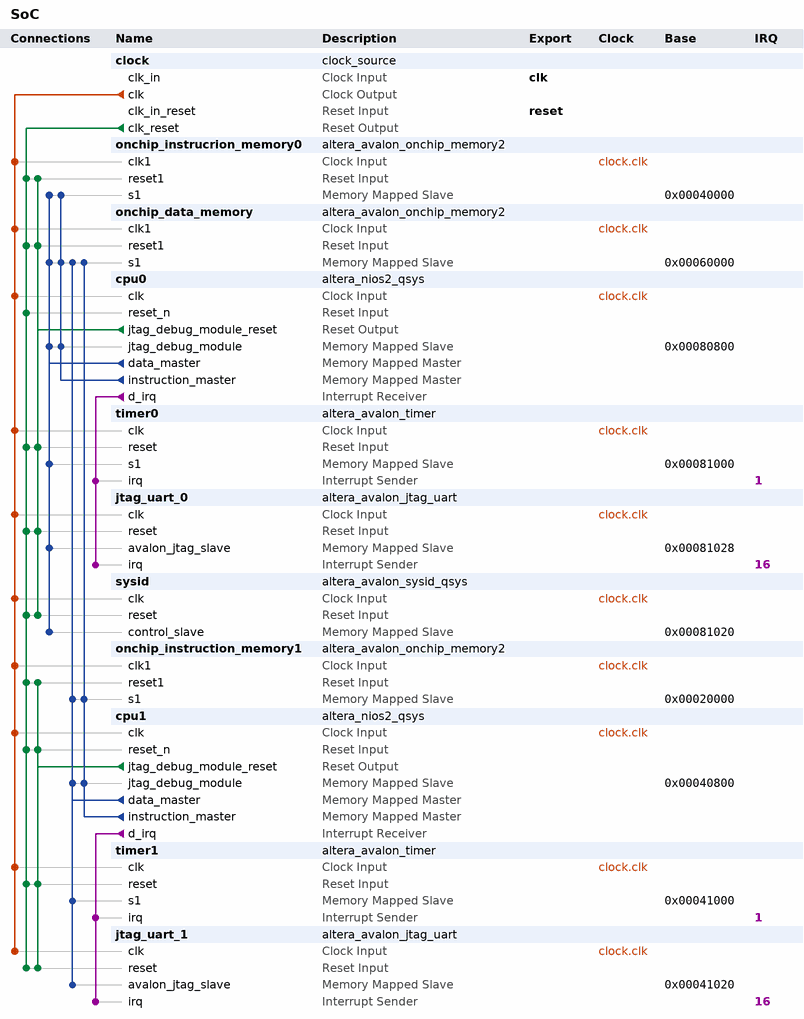
[diagram p0: system contents]
# Platform Designer (Qsys) system SoC, Cyclone IV E EP4CE115F29C7
# Parameters at their usual value, and those the tool derives, are not listed.
package require -exact qsys 12.1
create_system SoC
set_project_property DEVICE_FAMILY {Cyclone IV E}
set_project_property DEVICE EP4CE115F29C7

add_instance clock clock_source 12.1
set_instance_parameter_value clock clockFrequency 50000000

add_instance onchip_instrucrion_memory0 altera_avalon_onchip_memory2 12.1
set_instance_parameter_value onchip_instrucrion_memory0 dataWidth 32
set_instance_parameter_value onchip_instrucrion_memory0 dualPort false
set_instance_parameter_value onchip_instrucrion_memory0 initMemContent true
set_instance_parameter_value onchip_instrucrion_memory0 initializationFileName onchip_instrucrion_memory0
set_instance_parameter_value onchip_instrucrion_memory0 memorySize 98304

add_instance onchip_data_memory altera_avalon_onchip_memory2 12.1
set_instance_parameter_value onchip_data_memory dataWidth 32
set_instance_parameter_value onchip_data_memory dualPort false
set_instance_parameter_value onchip_data_memory initMemContent true
set_instance_parameter_value onchip_data_memory initializationFileName onchip_data_memory
set_instance_parameter_value onchip_data_memory memorySize 98304

add_instance cpu0 altera_nios2_qsys 12.1
set_instance_parameter_value cpu0 resetSlave onchip_instrucrion_memory0.s1
set_instance_parameter_value cpu0 exceptionSlave onchip_instrucrion_memory0.s1
set_instance_parameter_value cpu0 breakSlave cpu0.jtag_debug_module
set_instance_parameter_value cpu0 impl Small
set_instance_parameter_value cpu0 icache_size 4096

add_instance timer0 altera_avalon_timer 12.1
set_instance_parameter_value timer0 period 1
set_instance_parameter_value timer0 periodUnits MSEC
set_instance_parameter_value timer0 timerPreset CUSTOM

add_instance jtag_uart_0 altera_avalon_jtag_uart 12.1
set_instance_parameter_value jtag_uart_0 simInteractiveOptions INTERACTIVE_ASCII_OUTPUT

add_instance sysid altera_avalon_sysid_qsys 12.1
set_instance_parameter_value sysid id 0

add_instance onchip_instruction_memory1 altera_avalon_onchip_memory2 12.1
set_instance_parameter_value onchip_instruction_memory1 dataWidth 32
set_instance_parameter_value onchip_instruction_memory1 dualPort false
set_instance_parameter_value onchip_instruction_memory1 initMemContent true
set_instance_parameter_value onchip_instruction_memory1 initializationFileName onchip_instruction_memory1
set_instance_parameter_value onchip_instruction_memory1 memorySize 98304

add_instance cpu1 altera_nios2_qsys 12.1
set_instance_parameter_value cpu1 resetSlave onchip_instruction_memory1.s1
set_instance_parameter_value cpu1 exceptionSlave onchip_instruction_memory1.s1
set_instance_parameter_value cpu1 breakSlave cpu1.jtag_debug_module
set_instance_parameter_value cpu1 impl Small
set_instance_parameter_value cpu1 icache_size 4096

add_instance timer1 altera_avalon_timer 12.1
set_instance_parameter_value timer1 period 1
set_instance_parameter_value timer1 periodUnits MSEC
set_instance_parameter_value timer1 timerPreset CUSTOM

add_instance jtag_uart_1 altera_avalon_jtag_uart 12.1
set_instance_parameter_value jtag_uart_1 simInteractiveOptions INTERACTIVE_ASCII_OUTPUT

# connections
add_connection clock.clk cpu0.clk clock
add_connection clock.clk cpu1.clk clock
add_connection clock.clk jtag_uart_0.clk clock
add_connection clock.clk jtag_uart_1.clk clock
add_connection clock.clk onchip_data_memory.clk1 clock
add_connection clock.clk onchip_instrucrion_memory0.clk1 clock
add_connection clock.clk onchip_instruction_memory1.clk1 clock
add_connection clock.clk sysid.clk clock
add_connection clock.clk timer0.clk clock
add_connection clock.clk timer1.clk clock
add_connection clock.clk_reset cpu0.reset_n reset
add_connection clock.clk_reset cpu1.reset_n reset
add_connection clock.clk_reset jtag_uart_0.reset reset
add_connection clock.clk_reset jtag_uart_1.reset reset
add_connection clock.clk_reset onchip_data_memory.reset1 reset
add_connection clock.clk_reset onchip_instrucrion_memory0.reset1 reset
add_connection clock.clk_reset onchip_instruction_memory1.reset1 reset
add_connection clock.clk_reset sysid.reset reset
add_connection clock.clk_reset timer0.reset reset
add_connection clock.clk_reset timer1.reset reset
add_connection cpu0.jtag_debug_module_reset jtag_uart_0.reset reset
add_connection cpu0.jtag_debug_module_reset onchip_data_memory.reset1 reset
add_connection cpu0.jtag_debug_module_reset onchip_instrucrion_memory0.reset1 reset
add_connection cpu0.jtag_debug_module_reset sysid.reset reset
add_connection cpu0.jtag_debug_module_reset timer0.reset reset
add_connection cpu1.jtag_debug_module_reset cpu1.reset_n reset
add_connection cpu1.jtag_debug_module_reset jtag_uart_1.reset reset
add_connection cpu1.jtag_debug_module_reset onchip_instruction_memory1.reset1 reset
add_connection cpu1.jtag_debug_module_reset timer1.reset reset
add_connection cpu0.data_master cpu0.jtag_debug_module avalon
set_connection_parameter_value cpu0.data_master/cpu0.jtag_debug_module baseAddress 0x00080800
add_connection cpu0.data_master jtag_uart_0.avalon_jtag_slave avalon
set_connection_parameter_value cpu0.data_master/jtag_uart_0.avalon_jtag_slave baseAddress 0x00081028
add_connection cpu0.data_master onchip_data_memory.s1 avalon
set_connection_parameter_value cpu0.data_master/onchip_data_memory.s1 baseAddress 0x00060000
add_connection cpu0.data_master onchip_instrucrion_memory0.s1 avalon
set_connection_parameter_value cpu0.data_master/onchip_instrucrion_memory0.s1 baseAddress 0x00040000
add_connection cpu0.data_master sysid.control_slave avalon
set_connection_parameter_value cpu0.data_master/sysid.control_slave baseAddress 0x00081020
add_connection cpu0.data_master timer0.s1 avalon
set_connection_parameter_value cpu0.data_master/timer0.s1 baseAddress 0x00081000
add_connection cpu0.instruction_master cpu0.jtag_debug_module avalon
set_connection_parameter_value cpu0.instruction_master/cpu0.jtag_debug_module baseAddress 0x00080800
add_connection cpu0.instruction_master onchip_data_memory.s1 avalon
set_connection_parameter_value cpu0.instruction_master/onchip_data_memory.s1 baseAddress 0x00060000
add_connection cpu0.instruction_master onchip_instrucrion_memory0.s1 avalon
set_connection_parameter_value cpu0.instruction_master/onchip_instrucrion_memory0.s1 baseAddress 0x00040000
add_connection cpu1.data_master cpu1.jtag_debug_module avalon
set_connection_parameter_value cpu1.data_master/cpu1.jtag_debug_module baseAddress 0x00040800
add_connection cpu1.data_master jtag_uart_1.avalon_jtag_slave avalon
set_connection_parameter_value cpu1.data_master/jtag_uart_1.avalon_jtag_slave baseAddress 0x00041020
add_connection cpu1.data_master onchip_data_memory.s1 avalon
set_connection_parameter_value cpu1.data_master/onchip_data_memory.s1 baseAddress 0x00060000
add_connection cpu1.data_master onchip_instruction_memory1.s1 avalon
set_connection_parameter_value cpu1.data_master/onchip_instruction_memory1.s1 baseAddress 0x00020000
add_connection cpu1.data_master timer1.s1 avalon
set_connection_parameter_value cpu1.data_master/timer1.s1 baseAddress 0x00041000
add_connection cpu1.instruction_master cpu1.jtag_debug_module avalon
set_connection_parameter_value cpu1.instruction_master/cpu1.jtag_debug_module baseAddress 0x00040800
add_connection cpu1.instruction_master onchip_data_memory.s1 avalon
set_connection_parameter_value cpu1.instruction_master/onchip_data_memory.s1 baseAddress 0x00060000
add_connection cpu1.instruction_master onchip_instruction_memory1.s1 avalon
set_connection_parameter_value cpu1.instruction_master/onchip_instruction_memory1.s1 baseAddress 0x00020000
add_connection cpu0.d_irq jtag_uart_0.irq interrupt
set_connection_parameter_value cpu0.d_irq/jtag_uart_0.irq irqNumber 16
add_connection cpu0.d_irq timer0.irq interrupt
set_connection_parameter_value cpu0.d_irq/timer0.irq irqNumber 1
add_connection cpu1.d_irq jtag_uart_1.irq interrupt
set_connection_parameter_value cpu1.d_irq/jtag_uart_1.irq irqNumber 16
add_connection cpu1.d_irq timer1.irq interrupt
set_connection_parameter_value cpu1.d_irq/timer1.irq irqNumber 1

# exported interfaces
add_interface clk clock sink
set_interface_property clk EXPORT_OF clock.clk_in
add_interface reset reset sink
set_interface_property reset EXPORT_OF clock.clk_in_reset

save_system SoC.qsys
